# EAGLE design pepitaBadge (EAGLE 6.5.0)
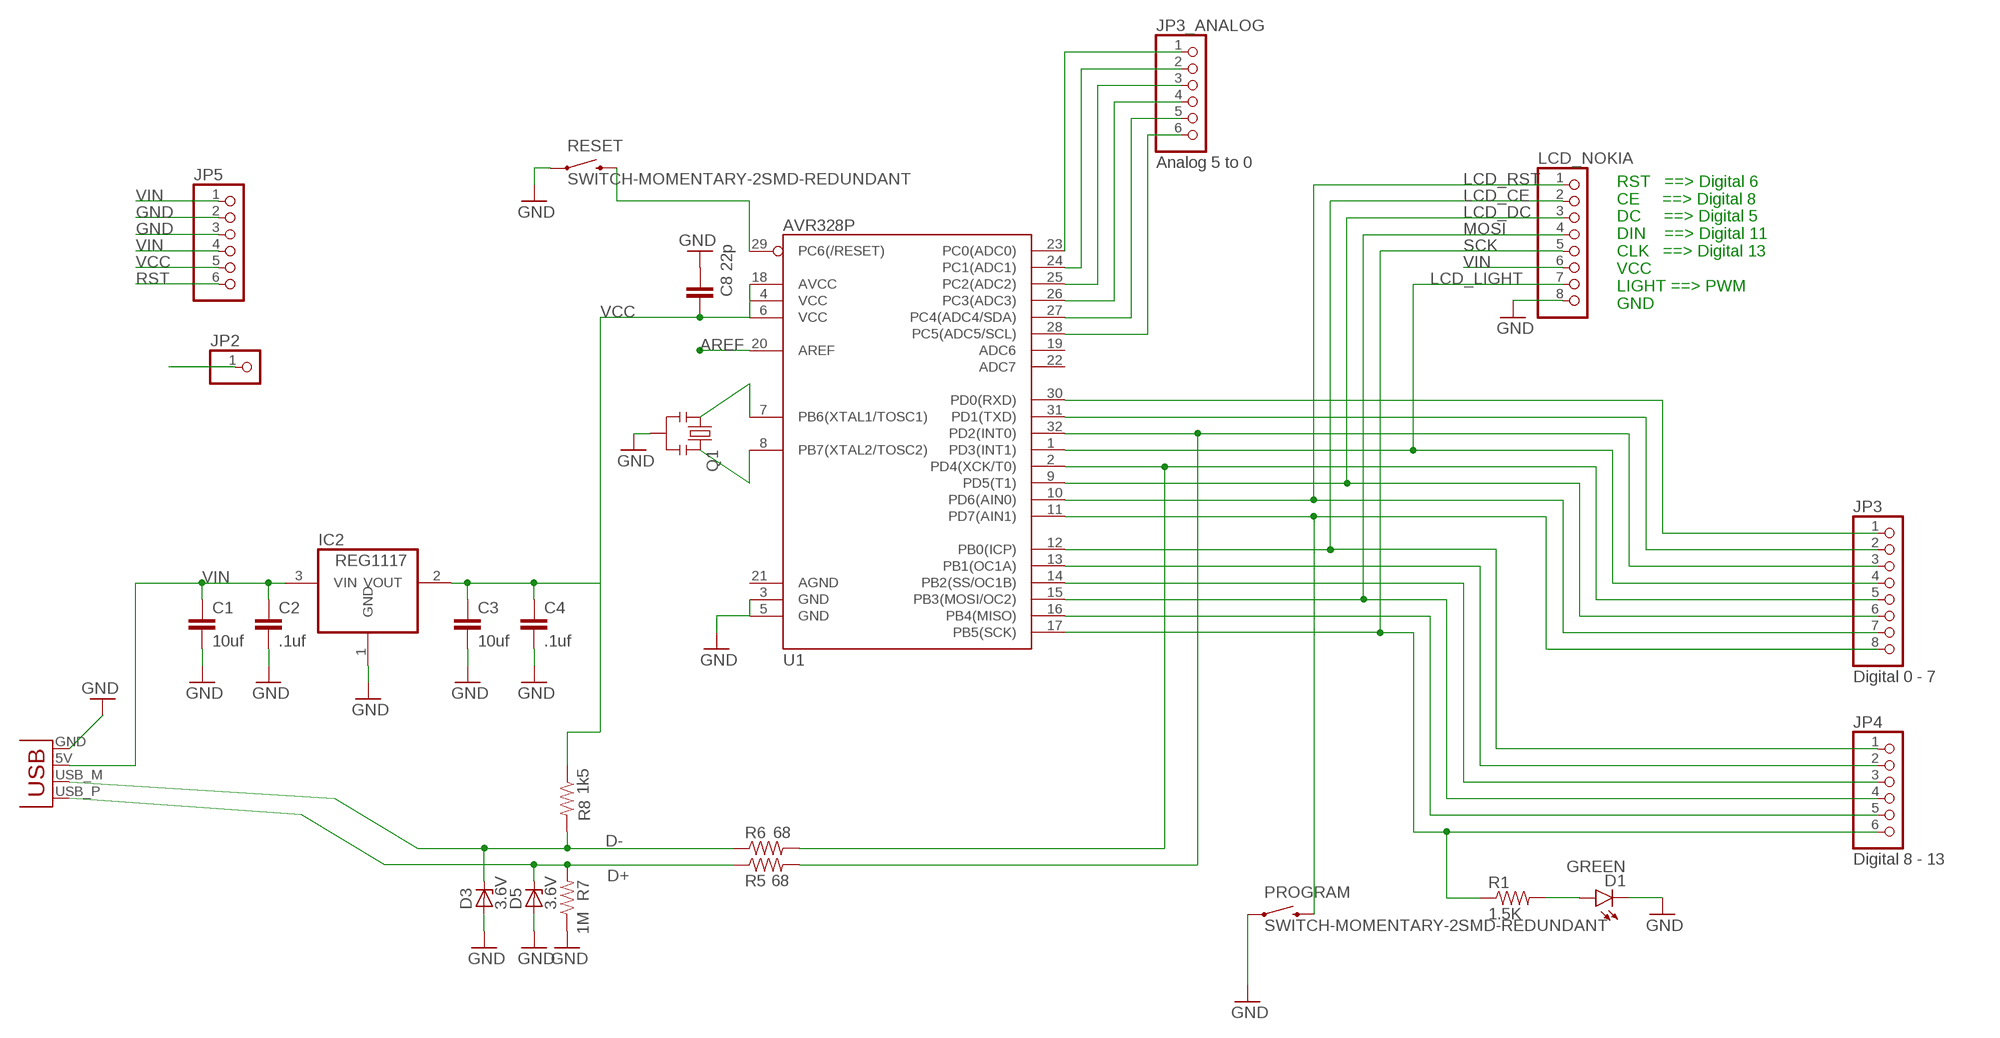
[diagram p0: schematic, sheet 1]

## Parts
C1  10uf  22UF-6.3V-20%(0805)  [0805]
C2  .1uf  CAP0603-CAP  [0603-CAP]
C3  10uf  22UF-6.3V-20%(0805)  [0805]
C4  .1uf  CAP0603-CAP  [0603-CAP]
C8  22p  CAP0603-CAP  [0603-CAP]
D1  GREEN  LED-GREEN0603  [LED-0603]
D3  3.6V  ZENER-DIODE  [1206]
D5  3.6V  ZENER-DIODE  [1206]
IC2  REG1117  [SOT223]
JP1  USBPCB  [USB-A-PCB]
JP2  PINHD-1X1  [1X01]
JP3  Digital 0 - 7  PINHD-1X8  [1X08]
JP3_ANALOG  Analog 5 to 0  PINHD-1X6  [1X06]
JP4  Digital 8 - 13  PINHD-1X6  [1X06]
JP5  PINHD-1X6  [1X06]
LCD_NOKIA  PINHD-1X8  [1X08]
PROGRAM  SWITCH-MOMENTARY-2SMD-REDUNDANT  [TACTILE-SWITCH-SMD]
Q1  RESONATOR16MHZ  [RESONATOR-SMD]
R1  1.5K  RESISTOR0603-RES  [0603-RES]
R5  68  RESISTOR0603-RES  [0603-RES]
R6  68  RESISTOR0603-RES  [0603-RES]
R7  1M  RESISTOR0603-RES  [0603-RES]
R8  1k5  RESISTOR0603-RES  [0603-RES]
RESET  SWITCH-MOMENTARY-2SMD-REDUNDANT  [TACTILE-SWITCH-SMD]
U1  AVR328P  ATMEGA328_SMT  [TQFP32-08]

## Nets
A5: JP3_ANALOG.6 U1.28(PC5(ADC5/SCL))
AREF: JP2.1 U1.20(AREF)
D+: D5.2(C) JP1.USB_P(D+) R5.1 R7.2
D-: D3.2(C) JP1.USB_M(D-) R6.1 R8.2
GND: C1.2 C2.2 C3.2 C4.2 C8.2 D1.C D3.1(A) D5.1(A) IC2.1(GND) JP1.GND JP5.2 JP5.3 LCD_NOKIA.8 PROGRAM.1 PROGRAM.2 Q1.2 R7.1 RESET.1 RESET.2 U1.3(GND) U1.5(GND)
LCD_CE: JP4.1 LCD_NOKIA.2 U1.12(PB0(ICP))
LCD_DC: JP3.6 LCD_NOKIA.3 U1.9(PD5(T1))
LCD_LIGHT: JP3.4 LCD_NOKIA.7 U1.1(PD3(INT1))
LCD_RST: JP3.7 LCD_NOKIA.1 U1.10(PD6(AIN0))
MISO: JP4.5 U1.16(PB4(MISO))
MOSI: JP4.4 LCD_NOKIA.4 U1.15(PB3(MOSI/OC2))
N$1: D1.A R1.2
N$2: JP3_ANALOG.5 U1.27(PC4(ADC4/SDA))
N$3: JP3_ANALOG.4 U1.26(PC3(ADC3))
N$4: JP3_ANALOG.3 U1.25(PC2(ADC2))
N$5: JP3.5 R6.2 U1.2(PD4(XCK/T0))
N$6: JP3_ANALOG.2 U1.24(PC1(ADC1))
N$7: Q1.1 U1.7(PB6(XTAL1/TOSC1))
N$8: JP3_ANALOG.1 U1.23(PC0(ADC0))
N$9: Q1.3 U1.8(PB7(XTAL2/TOSC2))
N$11: JP4.2 U1.13(PB1(OC1A))
N$12: JP4.3 U1.14(PB2(SS/OC1B))
N$26: JP3.3 R5.2 U1.32(PD2(INT0))
PD7: JP3.8 PROGRAM.3 PROGRAM.4 U1.11(PD7(AIN1))
RST: JP5.6 RESET.3 RESET.4 U1.29(PC6(/RESET))
RXD: JP3.1 U1.30(PD0(RXD))
SCK: JP4.6 LCD_NOKIA.5 R1.1 U1.17(PB5(SCK))
TXD: JP3.2 U1.31(PD1(TXD))
VCC: C3.1 C4.1 C8.1 IC2.2(VOUT) JP5.5 R8.1 U1.4(VCC) U1.6(VCC) U1.18(AVCC)
VIN: C1.1 C2.1 IC2.3(VIN) JP1.5V(VBUS) JP5.1 JP5.4 LCD_NOKIA.6
Unconnected: U1.19(ADC6) U1.21(AGND) U1.22(ADC7)

## Notes on the sheet
- RST   ==> Digital 6
  CE     ==> Digital 8
  DC     ==> Digital 5
  DIN    ==> Digital 11
  CLK   ==> Digital 13
  VCC
  LIGHT ==> PWM
  GND

## Library data of the parts
C1 C3 = SparkFun-Capacitors:22UF-6.3V-20%(0805): CAP-08402 Ceramic; PROD_ID: CAP-08402; VALUE: 22uF
C2 C4 C8 = SparkFun-Passives:CAP: Capacitor Standard 0603 ceramic capacitor, and 0.1" leaded capacitor.
D1 = SparkFun-LED:LED-GREEN: Various green LEDs Green LEDs used in SFE Production 0603- DIO-00821 LARGE- DIO-00862 LILYPAD- DIO-09910; PROD_ID: DIO-00821
D3 D5 = digital-ic:ZENER-DIODE: Z-Diode
IC2 = burr-brown:REG1117: 800mA and 1A Low Dropout (LDO) Positive Regulator 1.8V, 2.5V, 2.85V, 3.3V, 5V, and Adj; MPN: REG1117; OC_FARNELL: 1097566; OC_NEWARK: 14P6981
JP1 = SparkFun-Connectors:USB: USB Connectors USB-B-PTH is fully proven SKU : PRT-00139/CONN-08278 USB-miniB is fully proven SKU : PRT-00587 USB-A-PCB is untested. USB-A-H is throughly reviewed, but untested. Spark Fun Electronics SKU : PRT-00437 USB-B-SMT is throughly reviewed, but untested. Needs silkscreen touching up. USB-A-S has not been used/tested USB-MB-H has not been used/tested USB-MICROB has been used. CONN-09505
JP2 = pinhead:PINHD-1X1: PIN HEADER
JP3 LCD_NOKIA = pinhead:PINHD-1X8: PIN HEADER
JP3_ANALOG JP4 JP5 = pinhead:PINHD-1X6: PIN HEADER
PROGRAM RESET = SparkFun-Electromechanical:SWITCH-MOMENTARY-2: Various NO switches- pushbuttons, reed, etc
Q1 = SparkFun-FreqCtrl_Modified:RESONATOR: Resonator Small SMD resonator. Used, eg, on the Arduino Pro/ Pro Mini boards. 8MHz- XTAL-08895 16MHz- XTAL-08900; PROD_ID: XTAL-08900; VALUE: 16MHZ
R1 R5-R8 = SparkFun-Passives:RESISTOR: Resistor Basic schematic elements and footprints for 0603, 1206, and PTH resistors.
U1 = SparkFun-DigitalIC:ATMEGA328_SMT: 32-Pin Atmega328 part Commonly used on Arduino compatible boards Available in QFP and QFN packages TQFP is IC-09069 QFN is non-stock; PROD_ID: IC-09069; VALUE: ATMEGA328P

## Board
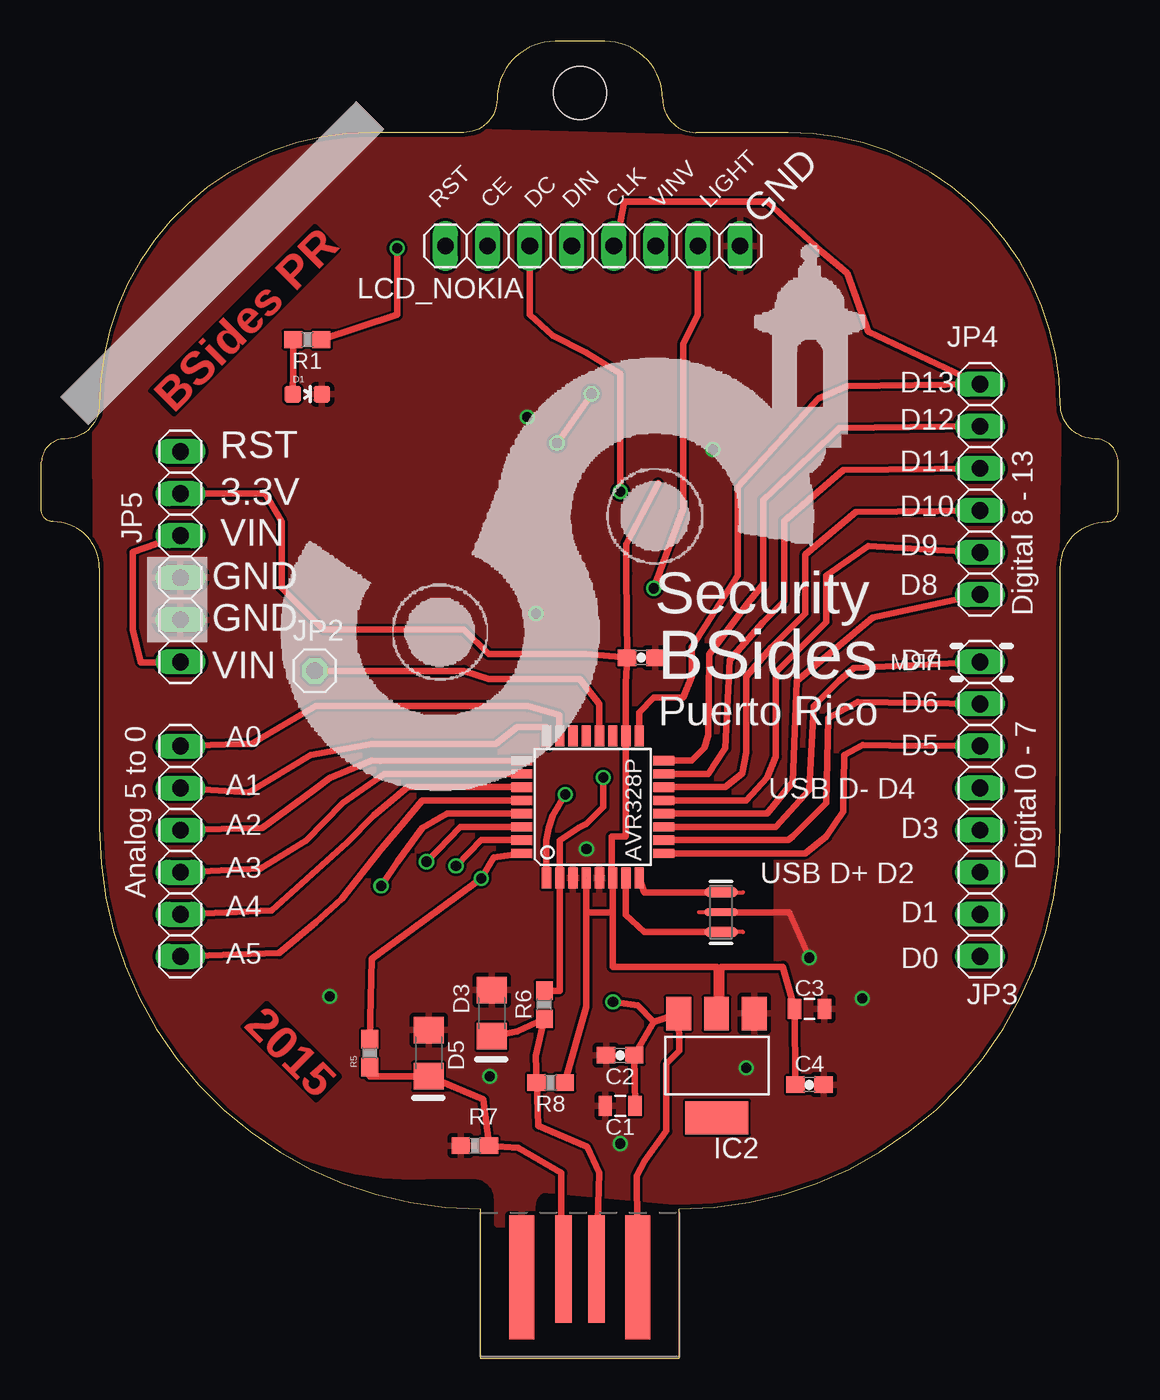
[diagram p1: board, top side]
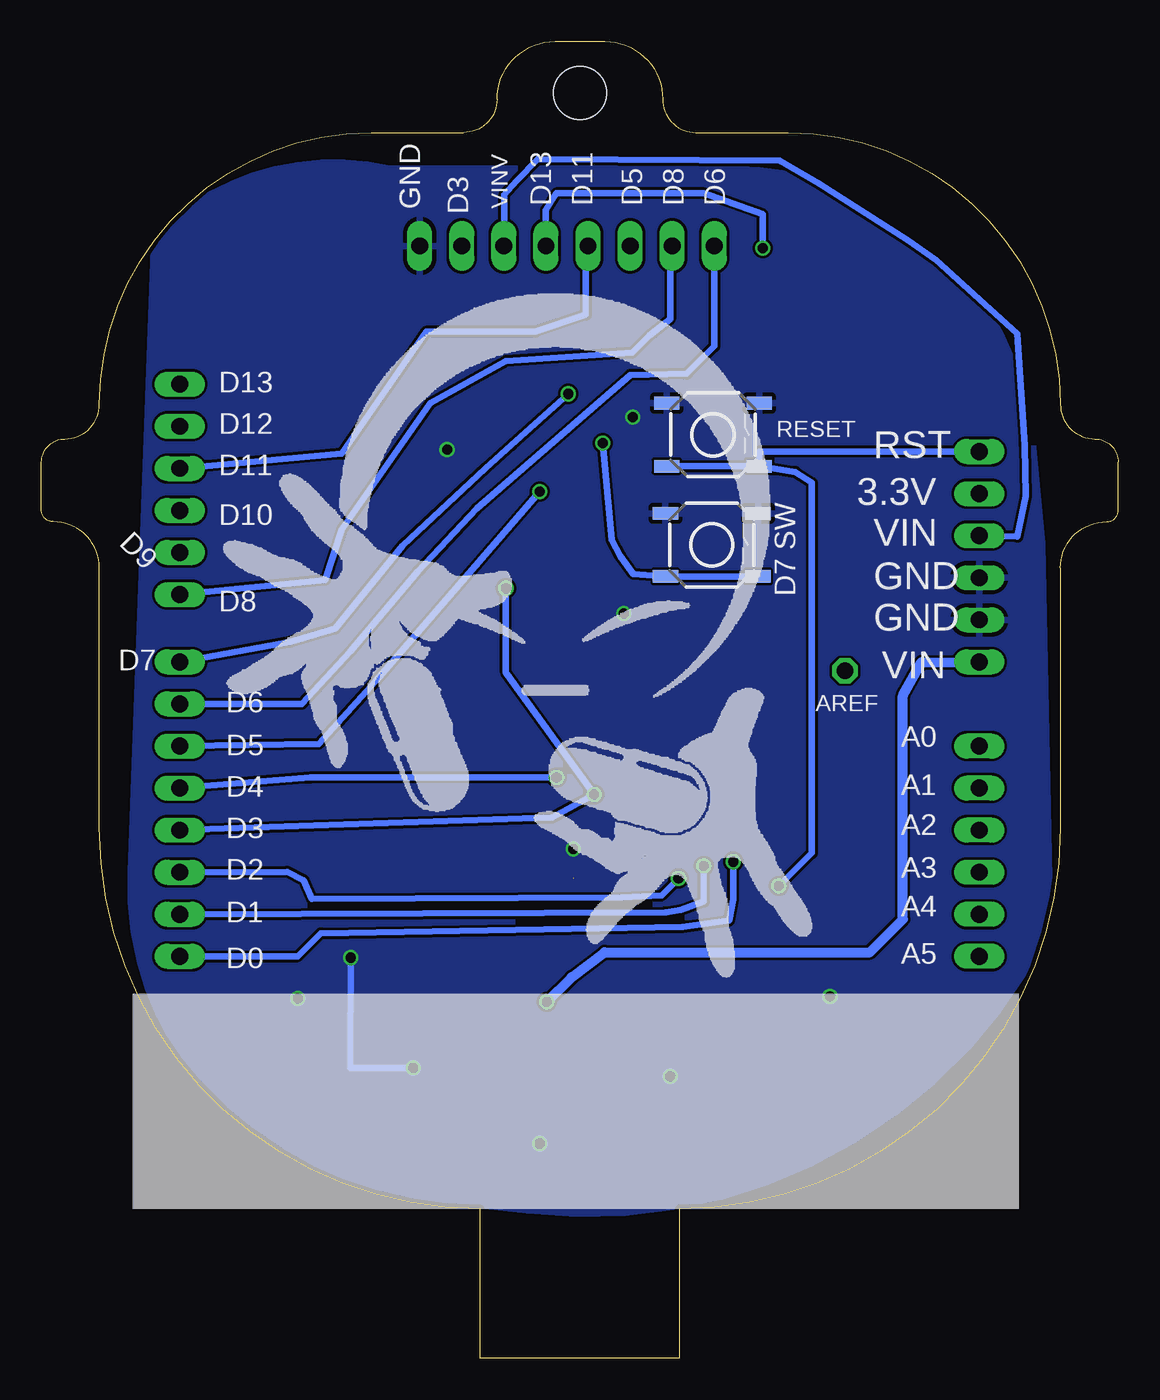
[diagram p2: board, bottom side, seen from below]

Size 65 x 79.5 mm. Coordinates in mm from the lower left corner, seen from the top.
Outline: 39.54,74 45.09,74 arc-90 61.5,57.59 arc90 63.59,55.5 arc-90 65,54.09 65,51.21 arc-90 64.29,50.5 arc90 61.5,47.71 61.5,32 arc-90 38.5,9 38.5,0 26.5,0 26.5,9 arc-90 3.5,32 3.5,47.71 arc90 0.71,50.5 arc-90 0,51.21 0,54.09 arc-90 1.41,55.5 arc90 3.5,57.59 arc-90 19.91,74 25.46,74
Outline: 39.5,74 arc-90 37.5,76 arc90 34,79.5 31,79.5 arc90 27.5,76 arc-90 25.5,74
Copper layers (1*16): Top 0.035mm / dielectric 1.5mm / Bottom 0.035mm
Design rules "SeeedStudio_2layer_DRU_no_angle_20140221": minimum track width 6mil, minimum drill 12mil, track to track 6mil, track to pad 6mil, pad to pad 6mil, via to via 6mil, smd to smd 0mil, copper to edge 10mil, drill to drill 10mil, minimum pad ring 10mil, minimum via ring 6mil, stop-mask expansion 2mil, vias tented up to drill 100mil, thermal gap 10mil
Holes 3.2 mm at 32.5,76.38

### Footprints (pad centres in the part's own frame; a part is rotated, then mirrored left to right if it is on the bottom)
0805 = smd 0.8 x 1.2: 1 -0.9,0; 2 0.9,0
0603-CAP = smd 1.1 x 1: 1 -0.85,0; 2 0.85,0
LED-0603 = smd 1 x 1: A 0,-0.877; C 0,0.877
1206 = smd 1.6 x 1.8: 1 -1.4,0; 2 1.4,0
SOT223 = smd 1.499 x 2.007: 1 -2.261,-3.15; 2 0.025,-3.15; 3 2.311,-3.15 | smd 3.81 x 2.007: 4 0,3.15
USB-A-PCB = smd 7.5 x 1.5: 5V -0.2,-3.5; GND -0.2,3.5 | smd 6.5 x 1: USB_M 0.3,-1; USB_P 0.3,1
1X01 = drill 1.016 octagon: 1 0,0
1X08 = drill 1.016 long: 1 -8.89,0; 2 -6.35,0; 3 -3.81,0; 4 -1.27,0; 5 1.27,0; 6 3.81,0; 7 6.35,0; 8 8.89,0
1X06 = drill 1.016 long: 1 -6.35,0; 2 -3.81,0; 3 -1.27,0; 4 1.27,0; 5 3.81,0; 6 6.35,0
TACTILE-SWITCH-SMD = smd 1.524 x 0.762: 1 -2.794,1.905; 2 2.794,1.905; 3 -2.794,-1.905; 4 2.794,-1.905
RESONATOR-SMD = smd 0.61 x 2.032: 1 -1.2,0; 3 1.2,0 | smd 0.45 x 2.032: 2 0,0
0603-RES = smd 1.1 x 1: 1 -0.85,0; 2 0.85,0
TQFP32-08 = smd 1.27 x 0.559: 1 -4.293,2.8; 2 -4.293,2; 3 -4.293,1.2; 4 -4.293,0.4; 5 -4.293,-0.4; 6 -4.293,-1.2; 7 -4.293,-2; 8 -4.293,-2.8; 17 4.293,-2.8; 18 4.293,-2; 19 4.293,-1.2; 20 4.293,-0.4; 21 4.293,0.4; 22 4.293,1.2; 23 4.293,2; 24 4.293,2.8 | smd 0.559 x 1.27: 9 -2.8,-4.293; 10 -2,-4.293; 11 -1.2,-4.293; 12 -0.4,-4.293; 13 0.4,-4.293; 14 1.2,-4.293; 15 2,-4.293; 16 2.8,-4.293; 25 2.8,4.293; 26 2,4.293; 27 1.2,4.293; 28 0.4,4.293; 29 -0.4,4.293; 30 -1.2,4.293; 31 -2,4.293; 32 -2.8,4.293

### Placement (x,y rotation side)
C1  34.93,15.24 180 top
C2  34.93,18.29 180 top
C3  46.36,21.08 0 top
C4  46.36,16.51 0 top
C8  36.2,42.29 0 top
D1  16.05,58.2 270 top
D3  27.18,20.83 270 top
D5  23.37,18.41 270 top
IC2  40.77,17.65 180 top
JP1  32.5,5.08 90 top
JP2  16.5,41.5 0 top
JP3  56.65,33.15 90 top
JP3_ANALOG  8.39,30.61 270 top
JP4  56.65,52.45 90 top
JP5  8.39,48.39 90 top
LCD_NOKIA  33.28,67.15 0 top
PROGRAM  24.54,49.1 0 bottom
Q1  41.02,26.92 90 top
R1  16.05,61.49 180 top
R5  19.82,18.41 90 top
R6  30.36,21.34 90 top
R7  26.17,12.83 0 top
R8  30.74,16.64 180 top
RESET  24.46,55.75 0 bottom
U1  33.28,33.27 90 top
U$2  [OBSIDISLOGO_BOTTOM]  18.5,23 0 top
U$5  [BSIDES_LOGO_NTB_PIC_ONLY]  17,35.5 0 top

### Tracks (layer width: path | path; a pad name or v marks a point on that pad's centre or on a via)
A5
  Top 0.406: U1.28 23.63,33.66 22.99,33.67 21.72,32.15 20.52,30.73 18.13,27.72 16.56,26.31 14.37,24.45 JP3_ANALOG.6
AREF
  Top 0.406: JP2.1 25.5,41.5 27,41 32.5,41 33.68,39.5 U1.20
D+
  Top 0.406: JP1.USB_P 31.38,5.38 31.38,11.18 28.79,12.7 R7.2 26.67,15.62 D5.2 19.82,17.02 R5.1
D-
  Top 0.406: JP1.USB_M 33.66,11.19 32.94,12.75 29.98,14.02 R8.2 29.85,18.25 R6.1 28.71,19.72 D3.2
GND  (via drill 0.61)
  Top 0.406: Q1.2 45.14,26.92 v46.33,24.18
  Bottom 0.406: v42.55,17.53 46.36,17.53 v46.33,24.18
  other vias: 29.32,56.82 40.52,54.86 29.85,44.96 17.4,21.84 27.05,17.02 34.93,12.95 32.9,30.73 49.53,21.72
  pour Top (isolate 0.018): 27.94,8.07 27.94,6.1 29.61,6.1 29.61,6.86 arc-90 29.73,8.74 arc-90 30.28,10.17 40.22,9.24 arc93 60.97,32.49 61.41,57.1 arc90 45.65,73.55 24.88,74.08 arc87 3.22,59.27 3.45,26.36 8.68,16.68 arc49 24,11 26.09,11 arc-90 27.5,9.59 27.5,8.07
  pour Bottom (isolate 0.016): 58.18,67.8 arc57 43.94,71.81 23.39,71.81 arc85 5.18,55.24 4.6,49.16 4.12,26.02 arc71 35.67,8.93 42.54,9.65 arc86 59.62,29.33
LCD_CE
  Top 0.406: U1.12 43.82,32.87 45.34,34.8 45.6,40.89 50.17,44.7 JP4.1
  Bottom 0.406: LCD_NOKIA.2 27.05,67.15 27.05,62.74 28.32,61.72 29.34,60.71 36.96,60.2 41.53,57.66 46.87,50.04 47.88,46.99 JP4.1
LCD_DC  (via drill 0.61)
  Top 0.406: U1.9 46.1,30.47 47.38,31.5 48.39,33.02 48.47,36.42 49.59,37.01 51.22,36.98 JP3.6 | v34.93,52.32 34.93,59.44 32.9,60.71 30.86,61.72 29.47,62.99 LCD_NOKIA.3
  Bottom 0.406: v34.93,52.32 44.84,40.89 48.26,37.08 JP3.6
LCD_LIGHT  (via drill 0.61)
  Top 0.406: v31.63,34.04 30.86,32.77 30.61,32 30.48,31.24 U1.1 | v36.96,46.48 38.74,51.31 38.74,61.21 39.63,62.99 LCD_NOKIA.7
  Bottom 0.406: JP3.4 34.17,32.64 v31.63,34.04 36.96,41.4 v36.96,46.48
LCD_RST
  Top 0.406: U1.10 45.09,31.27 45.34,31.5 47.38,33.53 47.5,38.63 49.28,39.62 JP3.7
  Bottom 0.406: LCD_NOKIA.1 24.39,61.09 26.04,59.44 29.47,59.36 38.74,51.31 42.3,47.5 46.36,42.67 49.28,39.5 JP3.7
MISO
  Top 0.406: U1.16 39.25,36.07 40.01,36.83 40.26,37.59 40.31,42.47 42.55,45.47 43.56,46.74 43.56,51.82 48.15,56.15 JP4.5
MOSI
  Top 0.406: U1.15 40.26,35.27 41.28,36.83 41.53,42.16 43.56,44.45 44.84,45.72 44.84,50.55 48.39,53.61 JP4.4
  Bottom 0.406: LCD_NOKIA.4 32.14,67.15 32.14,62.99 35.18,61.98 41.79,61.98 46.87,54.61 JP4.4
N$1
  Top 0.406: D1.A 15.2,59.7 R1.2
N$2
  Top 0.406: JP3_ANALOG.5 13.91,27.03 18.45,31.13 20.05,32.77 22.12,34.47 U1.27
N$3
  Top 0.406: U1.26 20.7,35.27 18.18,33.53 15.98,31.24 13.24,29.57 JP3_ANALOG.4
N$4
  Top 0.406: U1.25 20.45,36.07 19.94,36.07 17.41,35.04 16.41,34.27 13.32,32.01 JP3_ANALOG.3
N$5  (via drill 0.61)
  Top 0.406: v33.91,35.05 33.91,33.27 32.9,32.26 32.39,32 31.28,31.24 U1.2 31.28,22.19 R6.2
  Bottom 0.406: v33.91,35.05 48.77,35.05 JP3.5
N$6
  Top 0.254: 30.61,36.83 U1.24
  Top 0.406: JP3_ANALOG.2 12.52,34.15 16.27,36.41 19.94,37.08 27.44,37.08 28.71,38.1 30.48,38.1 U1.24
N$7
  Top 0.406: Q1.1 36.39,25.74 35.28,26.75 35.28,27.38 U1.7
N$8
  Top 0.406: U1.23 31.25,38.84 29.34,39.37 16.55,39.37 12.68,37.07 11.99,37.07 JP3_ANALOG.1
N$9
  Top 0.406: Q1.3 36.4,28.12 U1.8
N$10
  cutout Top (isolate 0.305): 38.5,24 44,24 44,30 38.5,30
N$11
  Top 0.406: U1.13 42.55,33.67 43.82,35.05 44.33,36.32 44.33,41.4 47.38,44.45 47.38,47.26 49.89,49.03 JP4.2
N$12
  Top 0.406: U1.14 41.28,34.47 42.3,35.31 42.55,36.58 42.55,41.15 44.07,42.93 46.1,44.96 46.1,48.53 49.14,51.07 JP4.3
N$26  (via drill 0.61)
  Top 0.406: U1.32 27.31,30.22 v26.55,28.96 19.94,24.09 R5.2
  Bottom 0.406: v26.55,28.96 27.56,27.94 29.98,27.81 48.67,27.71 49.15,28.83 50.17,29.36 JP3.3
PD7  (via drill 0.61)
  Top 0.406: U1.11 44.33,32.07 46.36,34.29 46.61,39.37 48.14,40.89 49.03,41.66 JP3.8 | v33.2,58.22 32.29,56.87 v31.12,55.24
  Bottom 0.406: v33.2,58.22 36.63,55.12 38.18,53.75 43.18,49.07 47.27,44.04 50.02,43.23 JP3.8 | v31.12,55.24 30.59,49.4 30.05,48.44 29.27,47.35 PROGRAM.3 PROGRAM.4
RST  (via drill 0.61)
  Top 0.406: U1.29 24.5,32.87 23,32 21.5,30 v20.5,28.5
  Bottom 0.406: RESET.3 RESET.4 | RESET.4 19.5,53.5 18.5,52.85 18.5,30.5 v20.5,28.5 | JP5.6 21.67,54.74 RESET.4
RXD  (via drill 0.61)
  Top 0.406: U1.30 25.28,32.07 v23.25,29.97
  Bottom 0.406: JP3.1 49.53,24.26 48.14,25.65 26.29,26.04 23.5,26.42 23.25,27.69 v23.25,29.97
SCK  (via drill 0.61)
  Top 0.406: R1.1 21.47,62.99 v21.47,67.02 | U1.17 36.08,38.99 36.96,39.88 38.74,39.88 39.25,41.15 39.25,42.93 42.04,47.24 42.04,52.58 46.88,57.92 48.65,58.69 JP4.6 49.91,61.98 48.65,65.5 47.12,66.77 43.82,69.81 35.17,69.81 34.67,67.15 LCD_NOKIA.5
  Bottom 0.406: v21.47,67.02 21.47,69.06 25.02,70.33 33.91,70.33 34.55,69.31 LCD_NOKIA.5
TXD  (via drill 0.61)
  Top 0.406: U1.31 26.55,31.27 v25.02,29.72
  Bottom 0.406: JP3.2 27.31,26.92 26.42,27.05 25.02,27.56 v25.02,29.72
VCC  (1 unrouted)
  Top 0.406: C4.1 C3.1 44.75,23.62 41.02,23.62 41.02,20.8 IC2.2 40.77,20.8 40.77,23.62 34.48,23.62 34.48,26.92 | 32.9,28.98 32.9,26.92 | 32.9,26.92 34.48,26.92 | 34.48,26.92 U1.6 34.42,28.98 34.42,31.5 35.28,31.5 U1.18 35.28,40.77 C8.1 | 32.9,26.92 32.9,21.21 R8.1 | C8.1 35.31,47.37 35.31,49.15 37.22,52.83 | JP5.5 13.5,52.2 14.5,50.5 14.5,46.5 17,44 25.5,44 27,42.5 32.85,42.5 C8.1
VIN  (via drill 0.61)
  Top 0.406: C1.1 C2.1 36.96,20.29 | JP1.5V 35.93,10.99 36.43,11.92 37.72,13.72 37.72,17.78 38.48,18.54 IC2.3 36.96,20.29 | JP5.4 5.5,48.66 5.5,44 6,42 8.39,42 JP5.1 | 36.96,20.29 36,21.29 v34.5,21.5
  Bottom 0.406: LCD_NOKIA.6 37.05,67.15 37.05,70.25 36.3,71.1 35.05,72.4 20.45,72.3 18.05,70.9 12.7,67.5 11,66.3 6.1,61.85 5.65,55.1 5.6,52.05 6.09,49.6 JP5.4
  Bottom 0.61: v34.5,21.5 33,23 31,24.5 15,24.5 13,26.5 13,40 11.89,42 JP5.1

### Text on the board
Top: BSides PR | 2015
tPlace: RST | CE | DC | DIN | CLK | VINV | LIGHT | GND | D13 | D12 | RST | D11 | 3.3V | D10 | VIN | D9 | GND | D8 | GND | D7 | PRM | VIN | D6 | A0 | D5 | A1 | USB D- D4 | A2 | D3 | A3 | USB D+ D2 | A4 | D1 | A5 | D0
bPlace: D11 | D13 | VINV | D8 | D5 | D3 | GND | D13 | D12 | RST | D11 | 3.3V | D10 | VIN | D9 | GND | D7 SW | D8 | GND | D7 | VIN | D6 | A0 | D5 | A1 | D4 | A2 | D3 | A3 | D2 | A4 | D1 | A5 | D0
tNames: Security | BSides | Puerto Rico
bNames: D6 | AREF